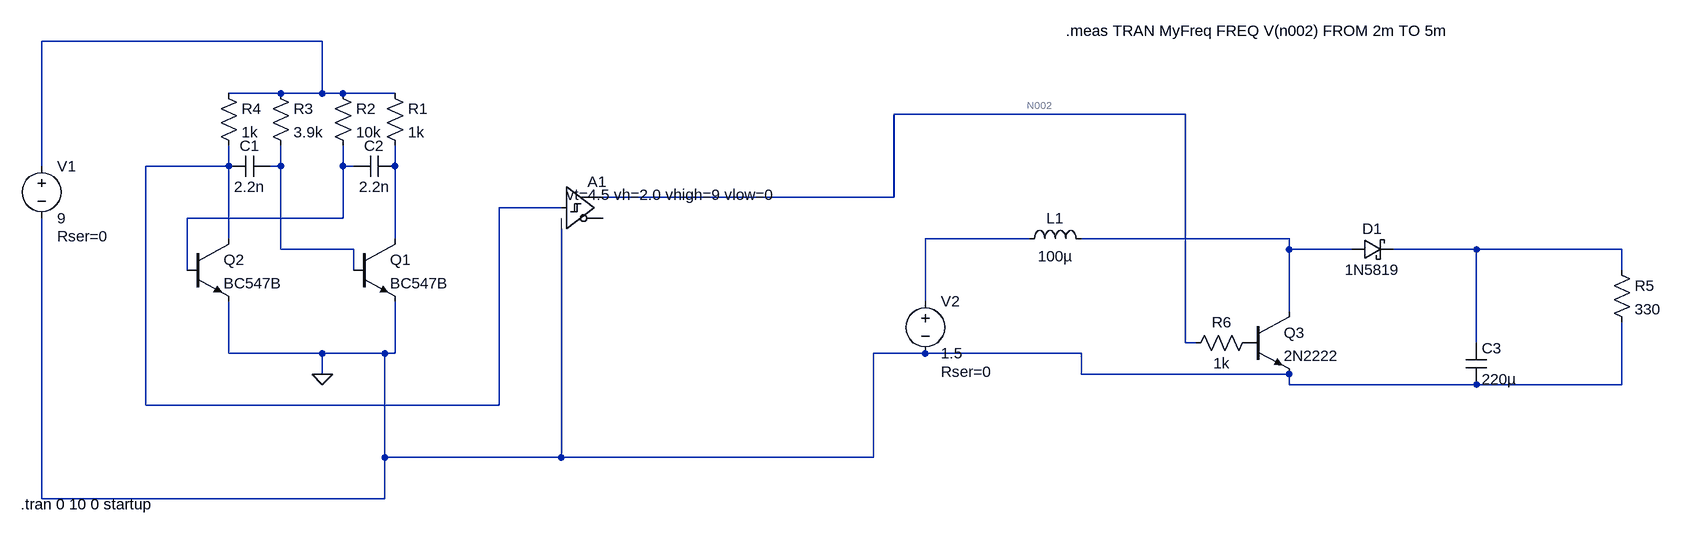
[diagram p0: schematic BoostConverter.asc]
BoostConverter.asc, the LTspice schematic file:
Version 4
SHEET 1 2264 680
WIRE 160 -176 -272 -176
WIRE 96 -96 16 -96
WIRE 160 -96 160 -176
WIRE 160 -96 96 -96
WIRE 192 -96 160 -96
WIRE 272 -96 192 -96
WIRE 1488 -64 1040 -64
WIRE -272 16 -272 -176
WIRE 16 16 16 -16
WIRE 16 16 -112 16
WIRE 96 16 96 -16
WIRE 96 16 80 16
WIRE 192 16 192 -16
WIRE 208 16 192 16
WIRE 272 16 272 -16
WIRE 1040 64 1040 -64
WIRE 1040 64 592 64
WIRE 528 80 432 80
WIRE 192 96 192 16
WIRE 192 96 -48 96
WIRE 16 128 16 16
WIRE 272 128 272 16
WIRE 1248 128 1088 128
WIRE 1648 128 1328 128
WIRE 96 144 96 16
WIRE 208 144 96 144
WIRE 1648 144 1648 128
WIRE 1744 144 1648 144
WIRE 1936 144 1808 144
WIRE 2160 144 1936 144
WIRE -48 176 -48 96
WIRE 208 176 208 144
WIRE 2160 176 2160 144
WIRE 1088 224 1088 128
WIRE 1648 240 1648 144
WIRE 1488 288 1488 -64
WIRE 1504 288 1488 288
WIRE 1936 288 1936 144
WIRE 16 304 16 224
WIRE 160 304 16 304
WIRE 256 304 160 304
WIRE 272 304 272 224
WIRE 272 304 256 304
WIRE 1088 304 1008 304
WIRE 1328 304 1088 304
WIRE 160 336 160 304
WIRE 1328 336 1328 304
WIRE 1648 336 1328 336
WIRE 1648 352 1648 336
WIRE 1936 352 1648 352
WIRE 2160 352 2160 256
WIRE 2160 352 1936 352
WIRE -112 384 -112 16
WIRE 432 384 432 80
WIRE 432 384 -112 384
WIRE 256 464 256 304
WIRE 528 464 528 112
WIRE 528 464 256 464
WIRE 1008 464 1008 304
WIRE 1008 464 528 464
WIRE -272 528 -272 96
WIRE 256 528 256 464
WIRE 256 528 -272 528
FLAG 160 336 0
SYMBOL npn 208 128 R0
SYMATTR InstName Q1
SYMATTR Value BC547B
SYMBOL npn -48 128 R0
SYMATTR InstName Q2
SYMATTR Value BC547B
SYMBOL res 256 -112 R0
SYMATTR InstName R1
SYMATTR Value 1k
SYMBOL res 176 -112 R0
SYMATTR InstName R2
SYMATTR Value 10k
SYMATTR SpiceLine tol=0
SYMBOL res 80 -112 R0
SYMATTR InstName R3
SYMATTR Value 3.9k
SYMATTR SpiceLine tol=0
SYMBOL res 0 -112 R0
SYMATTR InstName R4
SYMATTR Value 1k
SYMBOL cap 80 0 R90
WINDOW 0 0 32 VBottom 2
WINDOW 3 32 32 VTop 2
SYMATTR InstName C1
SYMATTR Value 2.2n
SYMBOL cap 272 0 R90
WINDOW 0 0 32 VBottom 2
WINDOW 3 32 32 VTop 2
SYMATTR InstName C2
SYMATTR Value 2.2n
SYMBOL voltage -272 0 R0
WINDOW 123 0 0 Left 0
WINDOW 39 24 124 Left 2
SYMATTR SpiceLine Rser=0
SYMATTR InstName V1
SYMATTR Value 9
SYMBOL Digital\\schmitt 528 16 R0
WINDOW 3 8 44 Left 2
SYMATTR Value vt=4.5 vh=2.0 vhigh=9 vlow=0
SYMATTR InstName A1
SYMBOL npn 1584 240 R0
SYMATTR InstName Q3
SYMATTR Value 2N2222
SYMBOL ind 1232 144 R270
WINDOW 0 32 56 VTop 2
WINDOW 3 5 56 VBottom 2
SYMATTR InstName L1
SYMATTR Value 100µ
SYMATTR SpiceLine Rser=0.8
SYMBOL cap 1920 288 R0
SYMATTR InstName C3
SYMATTR Value 220µ
SYMATTR SpiceLine Rser=0.5
SYMBOL voltage 1088 208 R0
WINDOW 123 0 0 Left 0
WINDOW 39 24 124 Left 2
SYMATTR SpiceLine Rser=0
SYMATTR InstName V2
SYMATTR Value 1.5
SYMBOL schottky 1744 160 R270
WINDOW 0 32 32 VTop 2
WINDOW 3 0 32 VBottom 2
SYMATTR InstName D1
SYMATTR Value 1N5819
SYMBOL res 2144 160 R0
SYMATTR InstName R5
SYMATTR Value 330
SYMBOL res 1600 272 R90
WINDOW 0 0 56 VBottom 2
WINDOW 3 32 56 VTop 2
SYMATTR InstName R6
SYMATTR Value 1k
TEXT -304 536 Left 2 !.tran 0 10 0 startup
TEXT 1304 -192 Left 2 !.meas TRAN MyFreq FREQ V(n002) FROM 2m TO 5m

The netlist it stands for:
* BoostConverter.asc
Q1 N006 N004 0 0 BC547B
Q2 N003 N005 0 0 BC547B
R1 N001 N006 1k
R2 N001 N005 10k tol=0
R3 N001 N004 3.9k tol=0
R4 N001 N003 1k
C1 N004 N003 2.2n
C2 N006 N005 2.2n
V1 N001 0 9 Rser=0
A1 N003 0 0 0 0 0 N002 0 SCHMITT vt=4.5 vh=2.0 vhigh=9 vlow=0
Q3 N008 P001 0 0 2N2222
L1 N007 N008 100µ Rser=0.8
C3 N009 0 220µ Rser=0.5
V2 N007 0 1.5 Rser=0
D1 N008 N009 1N5819
R5 N009 0 330
R6 P001 N002 1k
.model D D
.lib standard.dio
.model NPN NPN
.model PNP PNP
.lib standard.bjt
.tran 0 10 0 startup
.meas TRAN MyFreq FREQ V(n002) FROM 2m TO 5m
.backanno
.end